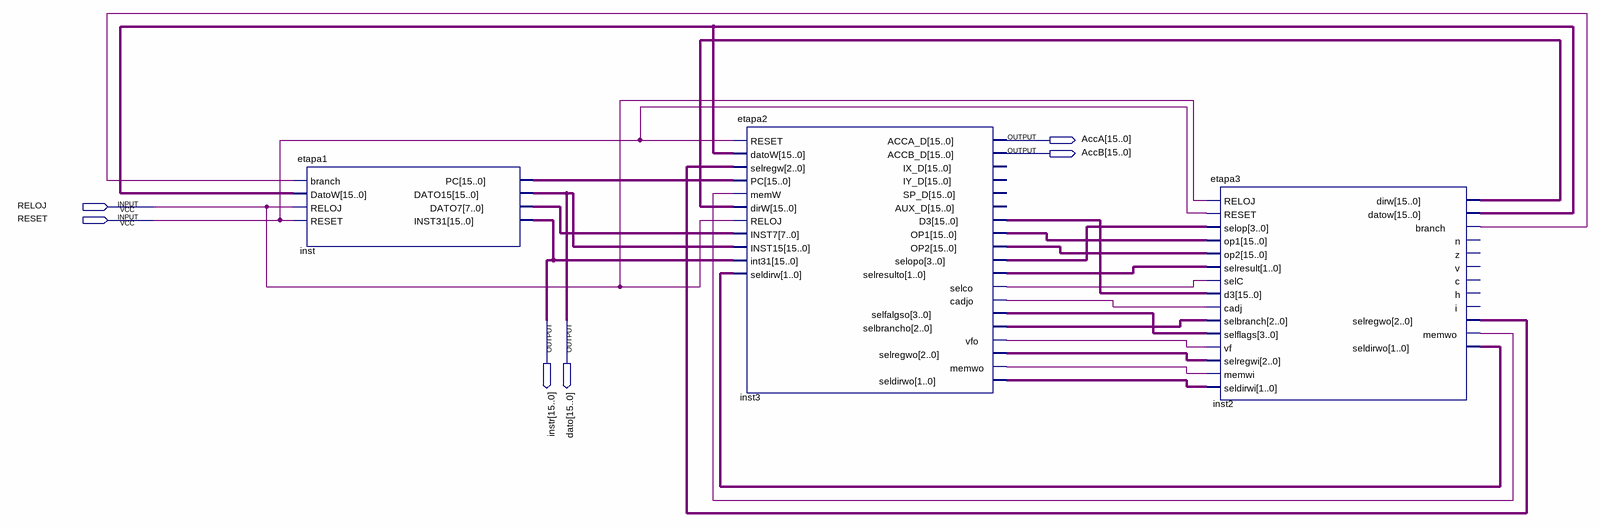
[diagram p0: schematic sheet]
// Quartus schematic pipeline.bdf as structural Verilog: 3 symbols, 6 pins
module pipeline (
  input  RELOJ,
  input  RESET,
  output [15:0] AccA,
  output [15:0] AccB,
  output [15:0] instr,
  output [15:0] dato
);

  wire inst2_branch, inst2_memwo, inst3_cadjo, inst3_memwo, inst3_selco, inst3_vfo;
  wire [1:0] inst2_seldirwo, inst3_seldirwo, inst3_selresulto;
  wire [2:0] inst2_selregwo, inst3_selbrancho, inst3_selregwo;
  wire [3:0] inst3_selfalgso, inst3_selopo;
  wire [7:0] inst_dato7;
  wire [15:0] inst2_datow, inst2_dirw, inst3_d3, inst3_op1, inst3_op2, inst_pc;

  etapa1 inst (
    .branch(inst2_branch), .DatoW(inst2_datow), .RELOJ(RELOJ), .RESET(RESET), .PC(inst_pc), .DATO15(dato),
    .DATO7(inst_dato7), .INST31(instr));
  etapa2 inst3 (
    .RESET(RESET), .datoW(inst2_datow), .selregw(inst2_selregwo), .PC(inst_pc), .memW(inst2_memwo),
    .dirW(inst2_dirw), .RELOJ(RELOJ), .INST7(inst_dato7), .INST15(dato), .int31(instr),
    .seldirw(inst2_seldirwo), .ACCA_D(AccA), .ACCB_D(AccB), .D3(inst3_d3), .OP1(inst3_op1), .OP2(inst3_op2),
    .selopo(inst3_selopo), .selresulto(inst3_selresulto), .selco(inst3_selco), .cadjo(inst3_cadjo),
    .selfalgso(inst3_selfalgso), .selbrancho(inst3_selbrancho), .vfo(inst3_vfo), .selregwo(inst3_selregwo),
    .memwo(inst3_memwo), .seldirwo(inst3_seldirwo));  // open: IX_D, IY_D, SP_D, AUX_D
  etapa3 inst2 (
    .RELOJ(RELOJ), .RESET(RESET), .selop(inst3_selopo), .op1(inst3_op1), .op2(inst3_op2),
    .selresult(inst3_selresulto), .selC(inst3_selco), .d3(inst3_d3), .cadj(inst3_cadjo),
    .selbranch(inst3_selbrancho), .selflags(inst3_selfalgso), .vf(inst3_vfo), .selregwi(inst3_selregwo),
    .memwi(inst3_memwo), .seldirwi(inst3_seldirwo), .dirw(inst2_dirw), .datow(inst2_datow),
    .branch(inst2_branch), .selregwo(inst2_selregwo), .memwo(inst2_memwo), .seldirwo(inst2_seldirwo));  // open: n, z, v, c, h, i
endmodule
